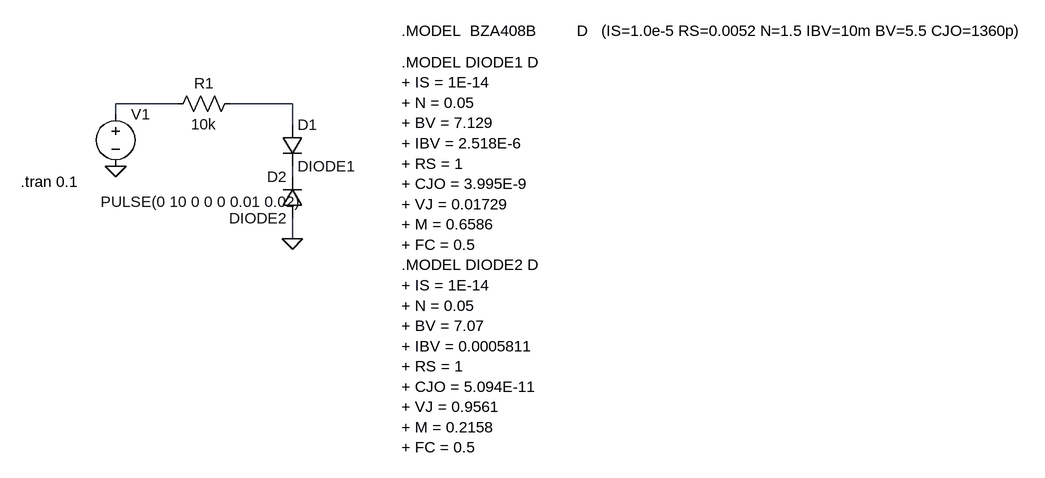
[diagram p0: schematic Draft18.asc]
Draft18.asc, the LTspice schematic file:
Version 4
SHEET 1 1436 868
WIRE 0 160 -96 160
WIRE 176 160 80 160
WIRE -96 176 -96 160
WIRE 176 192 176 160
WIRE 176 272 176 256
WIRE 176 368 176 336
FLAG 176 368 0
FLAG -96 256 0
SYMBOL voltage -96 160 R0
WINDOW 3 -23 151 Left 2
WINDOW 123 0 0 Left 2
WINDOW 39 0 0 Left 2
SYMATTR InstName V1
SYMATTR Value PULSE(0 10 0 0 0 0.01 0.02)
SYMBOL res 96 144 R90
WINDOW 0 0 56 VBottom 2
WINDOW 3 32 56 VTop 2
SYMATTR InstName R1
SYMATTR Value 10k
SYMBOL diode 160 192 R0
SYMATTR InstName D1
SYMATTR Value DIODE1
SYMBOL diode 192 336 R180
WINDOW 0 24 64 Left 2
WINDOW 3 24 0 Left 2
SYMATTR InstName D2
SYMATTR Value DIODE2
TEXT -242 280 Left 2 !.tran 0.1
TEXT 344 96 Left 2 !.MODEL DIODE1 D\n+ IS = 1E-14\n+ N = 0.05\n+ BV = 7.129\n+ IBV = 2.518E-6\n+ RS = 1\n+ CJO = 3.995E-9\n+ VJ = 0.01729\n+ M = 0.6586\n+ FC = 0.5\n.MODEL DIODE2 D\n+ IS = 1E-14\n+ N = 0.05\n+ BV = 7.07\n+ IBV = 0.0005811\n+ RS = 1\n+ CJO = 5.094E-11\n+ VJ = 0.9561\n+ M = 0.2158\n+ FC = 0.5
TEXT 344 48 Left 2 !.MODEL  BZA408B         D   (IS=1.0e-5 RS=0.0052 N=1.5 IBV=10m BV=5.5 CJO=1360p)

The netlist it stands for:
* Draft18.asc
V1 N001 0 PULSE(0 10 0 0 0 0.01 0.02)
R1 N002 N001 10k
D1 N002 N003 DIODE1
D2 0 N003 DIODE2
.model D D
.lib standard.dio
.tran 0.1
.MODEL DIODE1 D
+ IS = 1E-14
+ N = 0.05
+ BV = 7.129
+ IBV = 2.518E-6
+ RS = 1
+ CJO = 3.995E-9
+ VJ = 0.01729
+ M = 0.6586
+ FC = 0.5
.MODEL DIODE2 D
+ IS = 1E-14
+ N = 0.05
+ BV = 7.07
+ IBV = 0.0005811
+ RS = 1
+ CJO = 5.094E-11
+ VJ = 0.9561
+ M = 0.2158
+ FC = 0.5
.MODEL  BZA408B         D   (IS=1.0e-5 RS=0.0052 N=1.5 IBV=10m BV=5.5 CJO=1360p)
.backanno
.end